# Altium schematic sheet 795506519DJFLY-DG.SchDoc
size A4
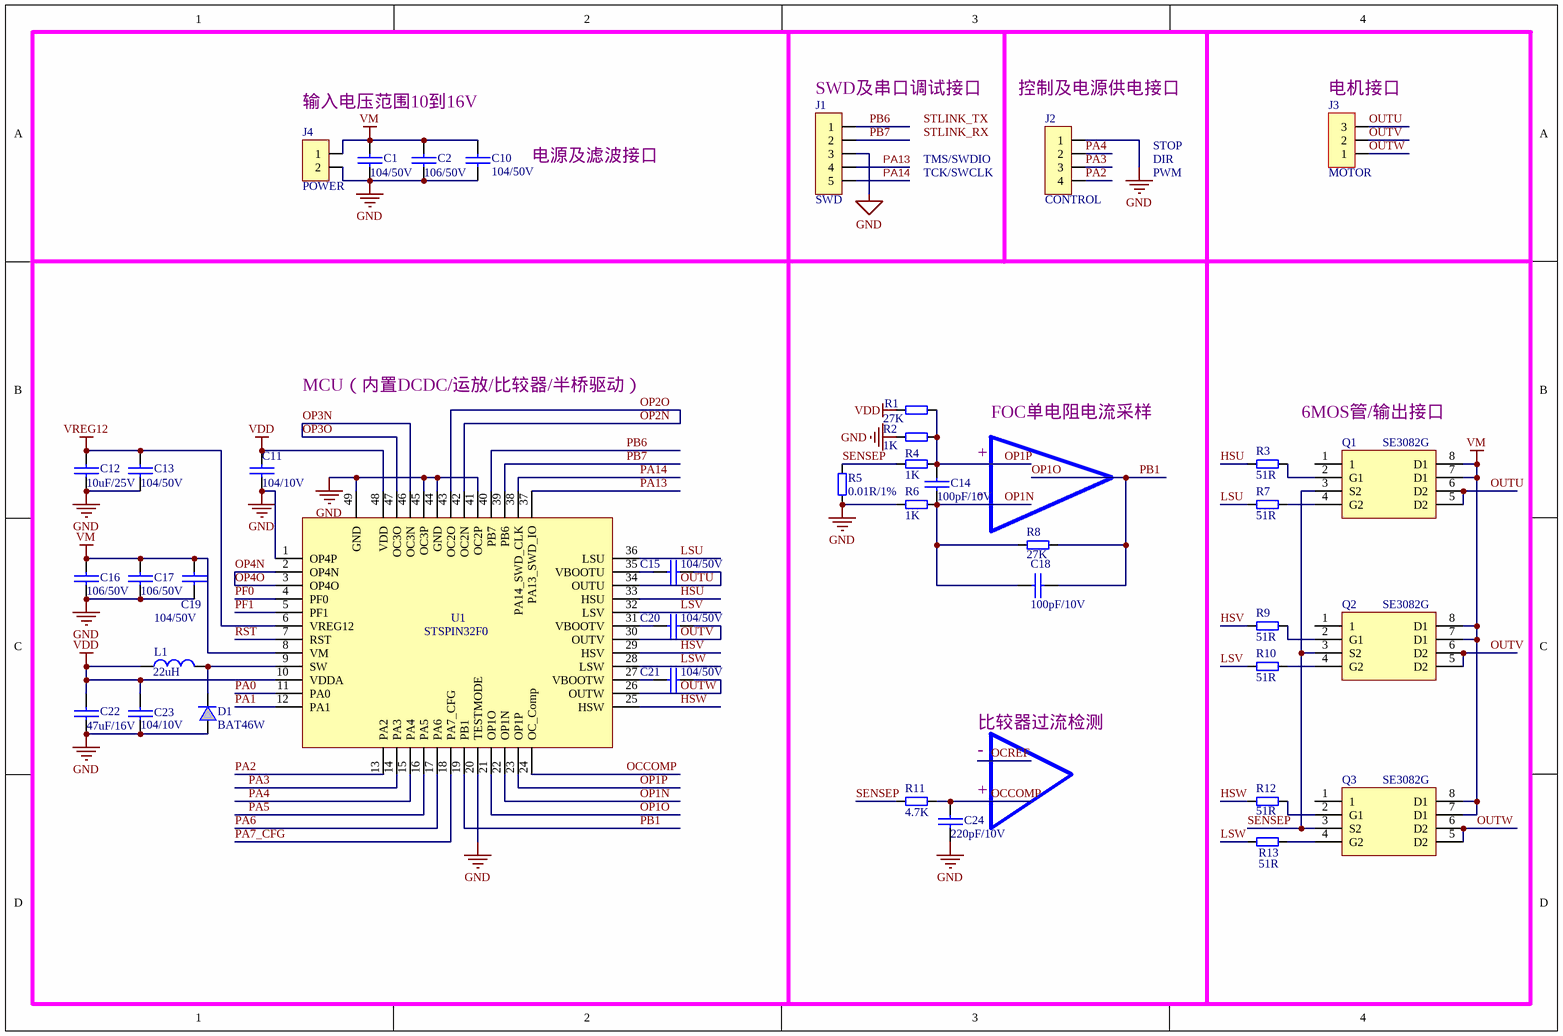
[diagram p0: 795506519DJFLY-DG.SchDoc]

## Parts
C1  104/50V  [0805C]
C2  106/50V  [1206C]
C10  104/50V  [0805C]
C11  104/10V  [0603C]
C12  10uF/25V  [1206C]
C13  104/50V  [0805C]
C14  100pF/10V  [0603C]
C15  104/50V  [0805C]
C16  106/50V  [1206C]
C17  106/50V  [1206C]
C18  100pF/10V  [0603C]
C19  104/50V  [0805C]
C20  104/50V  [0805C]
C21  104/50V  [0805C]
C22  47uF/16V  [1206C]
C23  104/10V  [0603C]
C24  220pF/10V  [0603C]
D1  BAT46W  [SOD-123]
J1  SWD  [SIP5]
J2  CONTROL  [SIP4]
J3  MOTOR  [POW-3.81-3S]
J4  POWER  [POW-3.81-2S]
L1  22uH  [1812c]
Q1  SE3082G  [DFN5*6]
Q2  SE3082G  [DFN5*6]
Q3  SE3082G  [DFN5*6]
R1  27K  [0603]
R2  1K  [0603]
R3  51R  [0805]
R4  1K  [0603]
R5  0.01R/1%  [2512-K]
R6  1K  [0603]
R7  51R  [0805]
R8  27K  [0603]
R9  51R  [0805]
R10  51R  [0805]
R11  4.7K  [0603]
R12  51R  [0805]
R13  51R  [0805]
U1  STSPIN32F0  [VFQFPN48]

## Nets
GND: C1.2 C2.2 C10.2 C11.2 C12.2 C13.2 C16.2 C17.2 C19.2 C22.2 C23.2 C24.2 D1.A J1.3 J2.1 J4.2 R2.1 R5.2 R6.2 U1.1(OP4P) U1.20(TESTMODE) U1.41(OC2P) U1.44(GND) U1.45(OC3P) U1.49(GND)
VDD: C11.1 C22.1 C23.1 L1.1 R1.2 U1.10(VDDA) U1.48(VDD)
VM: C1.1 C2.1 C10.1 C16.1 C17.1 C19.1 J4.1 Q1.7(D1) Q1.8(D1) Q2.7(D1) Q2.8(D1) Q3.7(D1) Q3.8(D1) U1.8(VM)
VREG12: C12.1 C13.1 U1.6(VREG12)
HSU: R3.1 U1.33(HSU)
HSV: R9.1 U1.29(HSV)
HSW: R12.1 U1.25(HSW)
LSU: R7.1 U1.36(LSU)
LSV: R10.1 U1.32(LSV)
LSW: R13.1 U1.28(LSW)
OCCOMP: C24.1 R11.1 U1.24(OC_Comp)
OP1N: C14.2 C18.1 R6.1 R8.2 U1.22(OP1N)
OP1O: C18.2 R8.1 U1.19(PB1) U1.21(OP1O)  [also labelled PB1]
OP1P: C14.1 R1.1 R2.2 R4.1 U1.23(OP1P)
OP2N: U1.42(OC2N) U1.43(OC2O)  [also labelled OP2O]
OP3N: U1.46(OC3N) U1.47(OC3O)  [also labelled OP3O]
OP4N: U1.2(OP4N) U1.3(OP4O)  [also labelled OP4O]
OUTU: C15.2 J3.3 Q1.5(D2) Q1.6(D2) U1.34(OUTU)
OUTV: C20.2 J3.2 Q2.5(D2) Q2.6(D2) U1.30(OUTV)
OUTW: C21.2 J3.1 Q3.5(D2) Q3.6(D2) U1.26(OUTW)
PA0: U1.11(PA0)
PA1: U1.12(PA1)
PA2: J2.4 U1.13(PA2)
PA3: J2.3 U1.14(PA3)
PA4: J2.2 U1.15(PA4)
PA5: U1.16(PA5)
PA6: U1.17(PA6)
PA7_CFG: U1.18(PA7_CFG)
PA13: J1.4 U1.37(PA13_SWD_IO)
PA14: J1.5 U1.38(PA14_SWD_CLK)
PB6: J1.1 U1.40(PB7)
PB7: J1.2 U1.39(PB6)
PF0: U1.4(PF0)
PF1: U1.5(PF1)
RST: U1.7(RST)
SENSEP: Q1.3(S2) Q2.3(S2) Q3.3(S2) R4.2 R5.1 R11.2
NetC15_1: C15.1 U1.35(VBOOTU)
NetC20_1: C20.1 U1.31(VBOOTV)
NetC21_1: C21.1 U1.27(VBOOTW)
NetD1_K: D1.K L1.2 U1.9(SW)
NetQ1_2: Q1.2(G1) R3.2
NetQ1_4: Q1.4(G2) R7.2
NetQ2_2: Q2.2(G1) R9.2
NetQ2_4: Q2.4(G2) R10.2
NetQ3_2: Q3.2(G1) R12.2
NetQ3_4: Q3.4(G2) R13.2

Not connected (* = marked no-connect by the designer): Q1 1; Q2 1; Q3 1

## Notes on the sheet
- 输入电压范围10到16V
- (near J1) SWD及串口调试接口
- (near J2) 控制及电源供电接口
- (near J3) 电机接口
- 电源及滤波接口
- TCK/SWCLK
- TMS/SWDIO
- STOP
- DIR
- PWM
- MCU（内置DCDC/运放/比较器/半桥驱动）
- FOC单电阻电流采样
- 6MOS管/输出接口
- -
- +
- 比较器过流检测
- (near C24) +
- Labels drawn without touching a wire or pin: STLINK_RX, STLINK_TX

## Library data of the parts
C1 C2 C10-C24 = C
D1 = D
J1 = CON5: CN
J2 = CON4: CN
J3 = CON3: CN
J4 = CON2: J
L1 = L: 10uH
R1-R13 = R: 10K